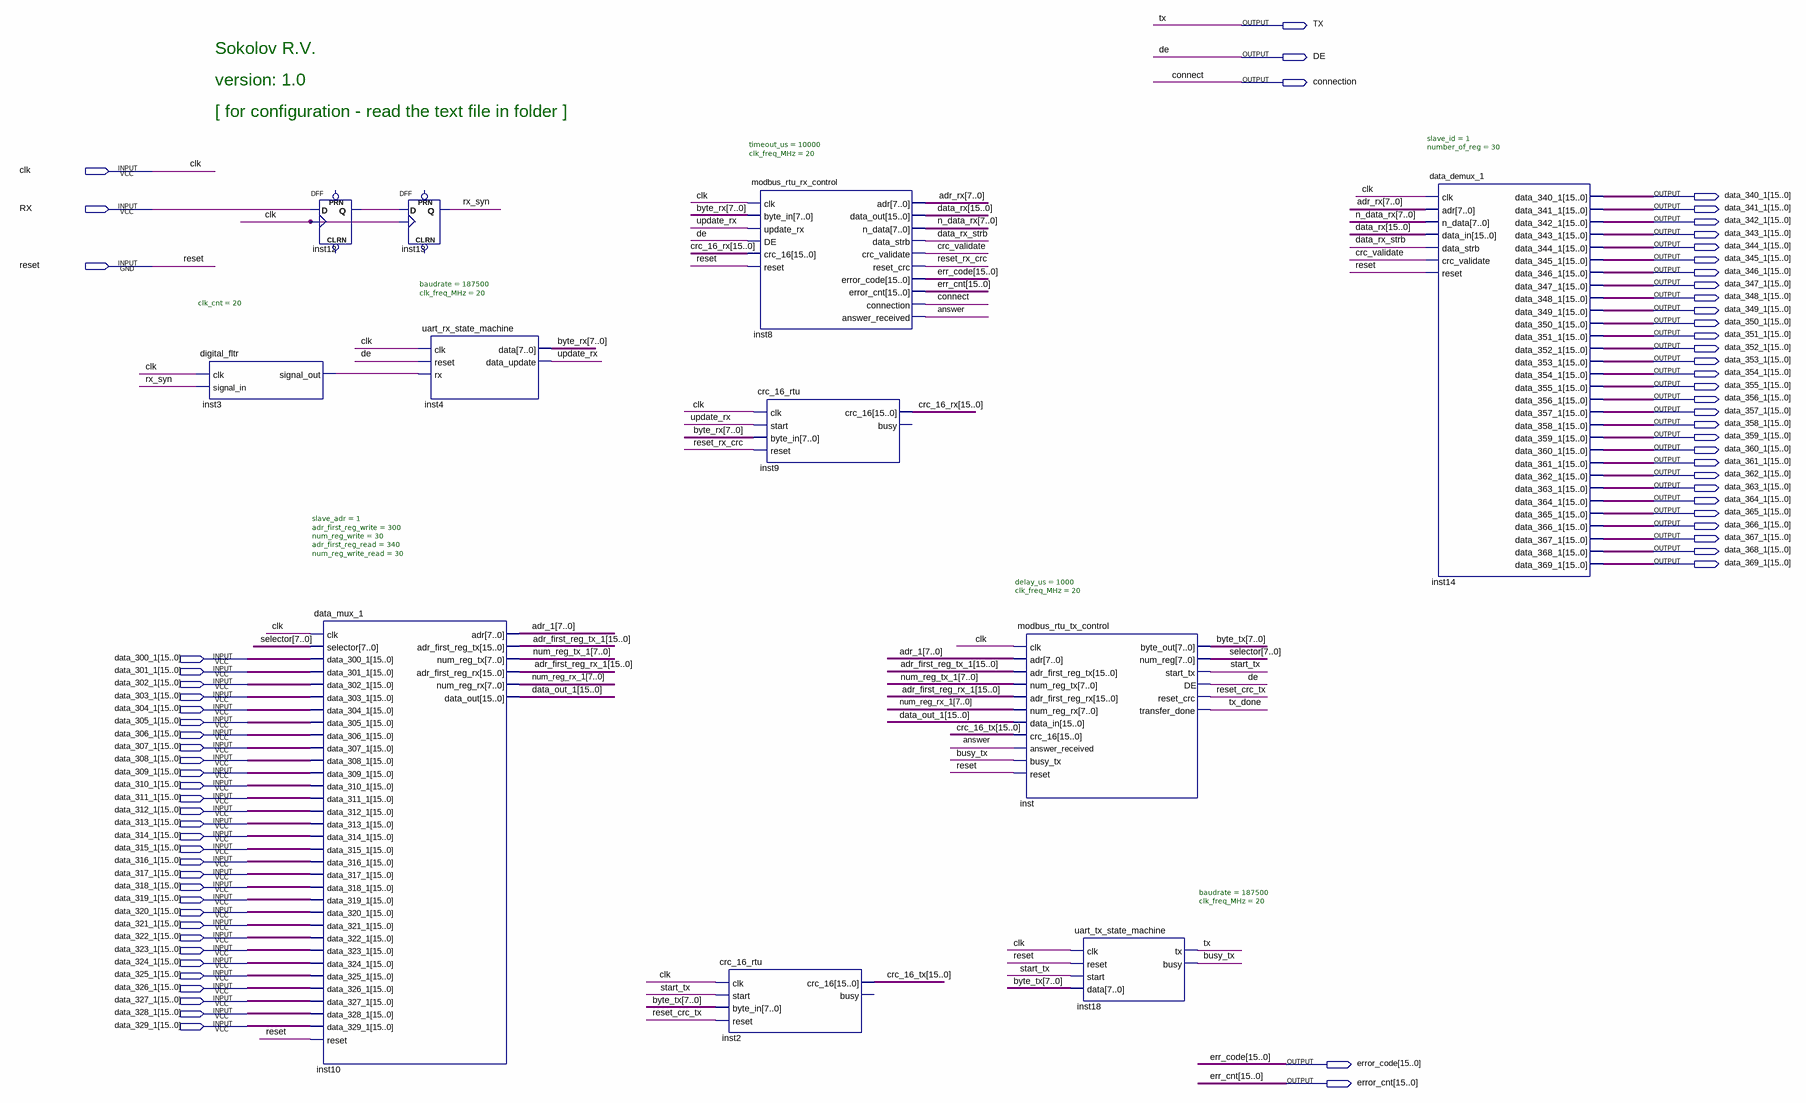
[diagram p0: schematic sheet]
// Quartus schematic Modbus_RTU_Master_v1.bdf as structural Verilog: 11 symbols, 68 pins
module Modbus_RTU_Master_v1 (
  input  clk,
  input  RX,
  input  reset,
  input  [15:0] data_300_1,
  input  [15:0] data_301_1,
  input  [15:0] data_302_1,
  input  [15:0] data_303_1,
  input  [15:0] data_304_1,
  input  [15:0] data_305_1,
  input  [15:0] data_306_1,
  input  [15:0] data_307_1,
  input  [15:0] data_308_1,
  input  [15:0] data_309_1,
  input  [15:0] data_310_1,
  input  [15:0] data_311_1,
  input  [15:0] data_312_1,
  input  [15:0] data_313_1,
  input  [15:0] data_314_1,
  input  [15:0] data_315_1,
  input  [15:0] data_316_1,
  input  [15:0] data_317_1,
  input  [15:0] data_318_1,
  input  [15:0] data_319_1,
  input  [15:0] data_320_1,
  input  [15:0] data_321_1,
  input  [15:0] data_322_1,
  input  [15:0] data_323_1,
  input  [15:0] data_324_1,
  input  [15:0] data_325_1,
  input  [15:0] data_326_1,
  input  [15:0] data_327_1,
  input  [15:0] data_328_1,
  input  [15:0] data_329_1,
  output TX,
  output DE,
  output connection,
  output [15:0] data_340_1,
  output [15:0] data_341_1,
  output [15:0] data_342_1,
  output [15:0] data_343_1,
  output [15:0] data_344_1,
  output [15:0] data_345_1,
  output [15:0] data_346_1,
  output [15:0] data_347_1,
  output [15:0] data_348_1,
  output [15:0] data_349_1,
  output [15:0] data_350_1,
  output [15:0] data_351_1,
  output [15:0] data_352_1,
  output [15:0] data_353_1,
  output [15:0] data_354_1,
  output [15:0] data_355_1,
  output [15:0] data_356_1,
  output [15:0] data_357_1,
  output [15:0] data_358_1,
  output [15:0] data_359_1,
  output [15:0] data_360_1,
  output [15:0] data_361_1,
  output [15:0] data_362_1,
  output [15:0] data_363_1,
  output [15:0] data_364_1,
  output [15:0] data_365_1,
  output [15:0] data_366_1,
  output [15:0] data_367_1,
  output [15:0] data_368_1,
  output [15:0] data_369_1,
  output [15:0] error_code,
  output [15:0] error_cnt
);

  wire answer, busy_tx, crc_validate, data_rx_strb, inst3_signal_out, inst12_q, reset_crc_tx, reset_rx_crc,
       rx_syn, start_tx, tx_done, update_rx;
  wire [7:0] adr_1, adr_rx, byte_rx, byte_tx, n_data_rx, num_reg_rx_1, num_reg_tx_1, selector;
  wire [15:0] adr_first_reg_rx_1, adr_first_reg_tx_1, crc_16_rx, crc_16_tx, data_out_1, data_rx;

  digital_fltr #(.clk_cnt(20)) inst3 (.clk(clk), .signal_in(rx_syn), .signal_out(inst3_signal_out));
  DFF inst12 (.CLK(clk), .D(RX), .Q(inst12_q));  // open: CLRN, PRN
  data_mux_1 #(.slave_adr(1), .adr_first_reg_write(300), .num_reg_write(30), .adr_first_reg_read(340), .num_reg_write_read(30)) inst10 (
    .clk(clk), .selector(selector), .data_300_1(data_300_1), .data_301_1(data_301_1),
    .data_302_1(data_302_1), .data_303_1(data_303_1), .data_304_1(data_304_1), .data_305_1(data_305_1),
    .data_306_1(data_306_1), .data_307_1(data_307_1), .data_308_1(data_308_1), .data_309_1(data_309_1),
    .data_310_1(data_310_1), .data_311_1(data_311_1), .data_312_1(data_312_1), .data_313_1(data_313_1),
    .data_314_1(data_314_1), .data_315_1(data_315_1), .data_316_1(data_316_1), .data_317_1(data_317_1),
    .data_318_1(data_318_1), .data_319_1(data_319_1), .data_320_1(data_320_1), .data_321_1(data_321_1),
    .data_322_1(data_322_1), .data_323_1(data_323_1), .data_324_1(data_324_1), .data_325_1(data_325_1),
    .data_326_1(data_326_1), .data_327_1(data_327_1), .data_328_1(data_328_1), .data_329_1(data_329_1),
    .reset(reset), .adr(adr_1), .adr_first_reg_tx(adr_first_reg_tx_1), .num_reg_tx(num_reg_tx_1),
    .adr_first_reg_rx(adr_first_reg_rx_1), .num_reg_rx(num_reg_rx_1), .data_out(data_out_1));
  DFF inst13 (.CLK(clk), .D(inst12_q), .Q(rx_syn));  // open: CLRN, PRN
  uart_rx_state_machine #(.baudrate(187500), .clk_freq_MHz(20)) inst4 (
    .clk(clk), .reset(DE), .rx(inst3_signal_out), .data(byte_rx), .data_update(update_rx));
  crc_16_rtu inst2 (
    .clk(clk), .start(start_tx), .byte_in(byte_tx), .reset(reset_crc_tx), .crc_16(crc_16_tx));  // open: busy
  modbus_rtu_rx_control #(.timeout_us(10000), .clk_freq_MHz(20)) inst8 (
    .clk(clk), .byte_in(byte_rx), .update_rx(update_rx), .DE(DE), .crc_16(crc_16_rx), .reset(reset),
    .adr(adr_rx), .data_out(data_rx), .n_data(n_data_rx), .data_strb(data_rx_strb),
    .crc_validate(crc_validate), .reset_crc(reset_rx_crc), .error_code(error_code), .error_cnt(error_cnt),
    .connection(connection), .answer_received(answer));
  crc_16_rtu inst9 (
    .clk(clk), .start(update_rx), .byte_in(byte_rx), .reset(reset_rx_crc), .crc_16(crc_16_rx));  // open: busy
  modbus_rtu_tx_control #(.delay_us(1000), .clk_freq_MHz(20)) inst (
    .clk(clk), .adr(adr_1), .adr_first_reg_tx(adr_first_reg_tx_1), .num_reg_tx(num_reg_tx_1),
    .adr_first_reg_rx(adr_first_reg_rx_1), .num_reg_rx(num_reg_rx_1), .data_in(data_out_1),
    .crc_16(crc_16_tx), .answer_received(answer), .busy_tx(busy_tx), .reset(reset), .byte_out(byte_tx),
    .num_reg(selector), .start_tx(start_tx), .DE(DE), .reset_crc(reset_crc_tx), .transfer_done(tx_done));
  uart_tx_state_machine #(.baudrate(187500), .clk_freq_MHz(20)) inst18 (
    .clk(clk), .reset(reset), .start(start_tx), .data(byte_tx), .tx(TX), .busy(busy_tx));
  data_demux_1 #(.slave_id(1), .number_of_reg(30)) inst14 (
    .clk(clk), .adr(adr_rx), .n_data(n_data_rx), .data_in(data_rx), .data_strb(data_rx_strb),
    .crc_validate(crc_validate), .reset(reset), .data_340_1(data_340_1), .data_341_1(data_341_1),
    .data_342_1(data_342_1), .data_343_1(data_343_1), .data_344_1(data_344_1), .data_345_1(data_345_1),
    .data_346_1(data_346_1), .data_347_1(data_347_1), .data_348_1(data_348_1), .data_349_1(data_349_1),
    .data_350_1(data_350_1), .data_351_1(data_351_1), .data_352_1(data_352_1), .data_353_1(data_353_1),
    .data_354_1(data_354_1), .data_355_1(data_355_1), .data_356_1(data_356_1), .data_357_1(data_357_1),
    .data_358_1(data_358_1), .data_359_1(data_359_1), .data_360_1(data_360_1), .data_361_1(data_361_1),
    .data_362_1(data_362_1), .data_363_1(data_363_1), .data_364_1(data_364_1), .data_365_1(data_365_1),
    .data_366_1(data_366_1), .data_367_1(data_367_1), .data_368_1(data_368_1), .data_369_1(data_369_1));

  // Other names for the same wires on the sheet: connect = connection; err_cnt[15:0] = error_cnt;
  //   err_code[15:0] = error_code

  // Notes on the sheet:
  //   Sokolov R.V.
  //   version: 1.0
  //   [ for configuration - read the text file in folder ]
endmodule
